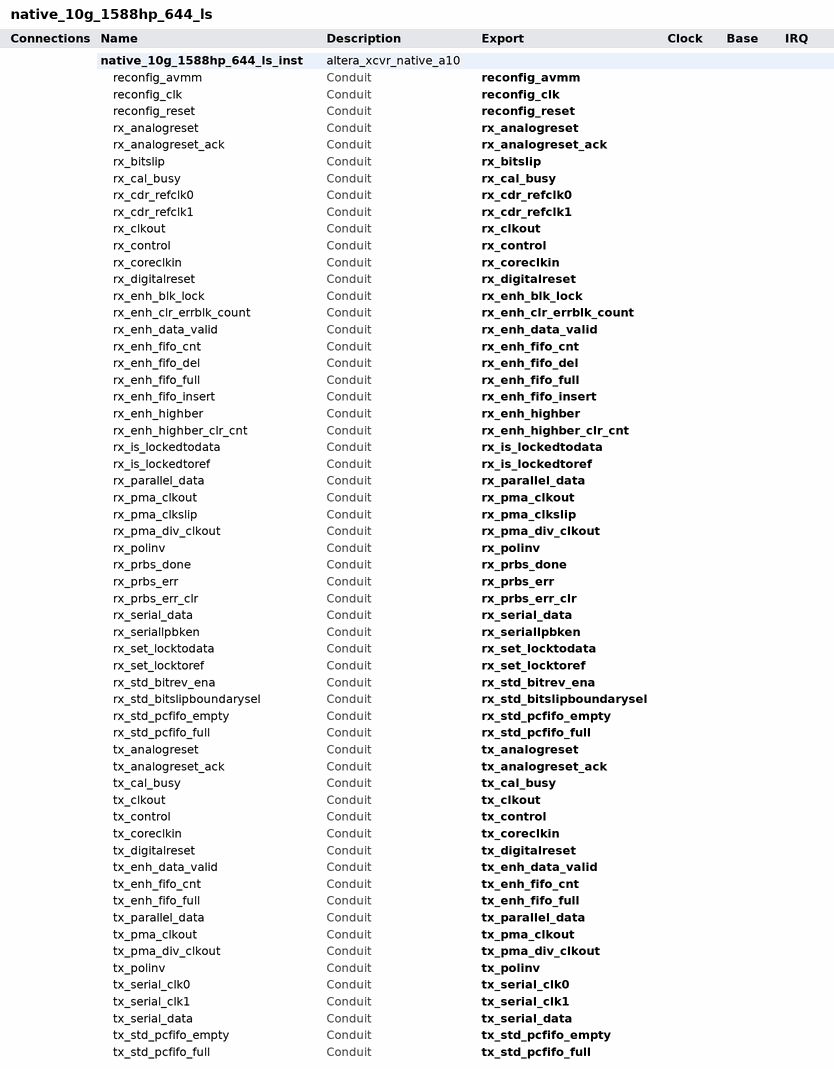
[diagram p0: system contents]
# Platform Designer (Qsys) system native_10g_1588hp_644_ls, Arria 10 10AX115U3F45I2SGE2
# Parameters at their usual value, and those the tool derives, are not listed.
package require -exact qsys 15.1
create_system native_10g_1588hp_644_ls
set_project_property DEVICE_FAMILY {Arria 10}
set_project_property DEVICE 10AX115U3F45I2SGE2

add_instance native_10g_1588hp_644_ls_inst altera_xcvr_native_a10 15.1
set_instance_property native_10g_1588hp_644_ls_inst AUTO_EXPORT true
set_instance_parameter_value native_10g_1588hp_644_ls_inst anlg_voltage 1_0V
set_instance_parameter_value native_10g_1588hp_644_ls_inst base_device NIGHTFURY5ES2
set_instance_parameter_value native_10g_1588hp_644_ls_inst bonded_mode not_bonded
set_instance_parameter_value native_10g_1588hp_644_ls_inst cdr_refclk_cnt 2
set_instance_parameter_value native_10g_1588hp_644_ls_inst channels 1
set_instance_parameter_value native_10g_1588hp_644_ls_inst disconnect_analog_resets 0
set_instance_parameter_value native_10g_1588hp_644_ls_inst enable_port_rx_analog_reset_ack 1
set_instance_parameter_value native_10g_1588hp_644_ls_inst enable_port_rx_enh_bitslip 1
set_instance_parameter_value native_10g_1588hp_644_ls_inst enable_port_rx_enh_blk_lock 1
set_instance_parameter_value native_10g_1588hp_644_ls_inst enable_port_rx_enh_clr_errblk_count 1
set_instance_parameter_value native_10g_1588hp_644_ls_inst enable_port_rx_enh_data_valid 1
set_instance_parameter_value native_10g_1588hp_644_ls_inst enable_port_rx_enh_fifo_cnt 1
set_instance_parameter_value native_10g_1588hp_644_ls_inst enable_port_rx_enh_fifo_del 1
set_instance_parameter_value native_10g_1588hp_644_ls_inst enable_port_rx_enh_fifo_full 1
set_instance_parameter_value native_10g_1588hp_644_ls_inst enable_port_rx_enh_fifo_insert 1
set_instance_parameter_value native_10g_1588hp_644_ls_inst enable_port_rx_enh_fifo_rd_en 0
set_instance_parameter_value native_10g_1588hp_644_ls_inst enable_port_rx_enh_highber 1
set_instance_parameter_value native_10g_1588hp_644_ls_inst enable_port_rx_enh_highber_clr_cnt 1
set_instance_parameter_value native_10g_1588hp_644_ls_inst enable_port_rx_pma_clkout 1
set_instance_parameter_value native_10g_1588hp_644_ls_inst enable_port_rx_pma_clkslip 1
set_instance_parameter_value native_10g_1588hp_644_ls_inst enable_port_rx_pma_div_clkout 1
set_instance_parameter_value native_10g_1588hp_644_ls_inst enable_port_rx_polinv 1
set_instance_parameter_value native_10g_1588hp_644_ls_inst enable_port_rx_seriallpbken_tx 0
set_instance_parameter_value native_10g_1588hp_644_ls_inst enable_port_rx_std_bitrev_ena 1
set_instance_parameter_value native_10g_1588hp_644_ls_inst enable_port_rx_std_bitslip 0
set_instance_parameter_value native_10g_1588hp_644_ls_inst enable_port_rx_std_bitslipboundarysel 1
set_instance_parameter_value native_10g_1588hp_644_ls_inst enable_port_rx_std_pcfifo_empty 1
set_instance_parameter_value native_10g_1588hp_644_ls_inst enable_port_rx_std_pcfifo_full 1
set_instance_parameter_value native_10g_1588hp_644_ls_inst enable_port_tx_analog_reset_ack 1
set_instance_parameter_value native_10g_1588hp_644_ls_inst enable_port_tx_enh_fifo_cnt 1
set_instance_parameter_value native_10g_1588hp_644_ls_inst enable_port_tx_enh_fifo_full 1
set_instance_parameter_value native_10g_1588hp_644_ls_inst enable_port_tx_enh_fifo_pfull 0
set_instance_parameter_value native_10g_1588hp_644_ls_inst enable_port_tx_pma_clkout 1
set_instance_parameter_value native_10g_1588hp_644_ls_inst enable_port_tx_pma_div_clkout 1
set_instance_parameter_value native_10g_1588hp_644_ls_inst enable_port_tx_polinv 1
set_instance_parameter_value native_10g_1588hp_644_ls_inst enable_port_tx_std_pcfifo_empty 1
set_instance_parameter_value native_10g_1588hp_644_ls_inst enable_port_tx_std_pcfifo_full 1
set_instance_parameter_value native_10g_1588hp_644_ls_inst enable_ports_rx_manual_cdr_mode 1
set_instance_parameter_value native_10g_1588hp_644_ls_inst enable_ports_rx_prbs 1
set_instance_parameter_value native_10g_1588hp_644_ls_inst enable_simple_interface 0
set_instance_parameter_value native_10g_1588hp_644_ls_inst enh_pcs_pma_width 40
set_instance_parameter_value native_10g_1588hp_644_ls_inst enh_pld_pcs_width 66
set_instance_parameter_value native_10g_1588hp_644_ls_inst enh_rx_64b66b_enable 1
set_instance_parameter_value native_10g_1588hp_644_ls_inst enh_rx_blksync_enable 1
set_instance_parameter_value native_10g_1588hp_644_ls_inst enh_rx_descram_enable 1
set_instance_parameter_value native_10g_1588hp_644_ls_inst enh_rxfifo_mode Register
set_instance_parameter_value native_10g_1588hp_644_ls_inst enh_tx_64b66b_enable 1
set_instance_parameter_value native_10g_1588hp_644_ls_inst enh_tx_scram_enable 1
set_instance_parameter_value native_10g_1588hp_644_ls_inst enh_tx_scram_seed 288230376151711743
set_instance_parameter_value native_10g_1588hp_644_ls_inst enh_txfifo_mode {Fast register}
set_instance_parameter_value native_10g_1588hp_644_ls_inst generate_add_hdl_instance_example 1
set_instance_parameter_value native_10g_1588hp_644_ls_inst generate_docs 1
set_instance_parameter_value native_10g_1588hp_644_ls_inst plls 2
set_instance_parameter_value native_10g_1588hp_644_ls_inst protocol_mode teng_1588_mode
set_instance_parameter_value native_10g_1588hp_644_ls_inst rapid_validate 0
set_instance_parameter_value native_10g_1588hp_644_ls_inst rcfg_h_file_enable 1
set_instance_parameter_value native_10g_1588hp_644_ls_inst rcfg_iface_enable 1
set_instance_parameter_value native_10g_1588hp_644_ls_inst rcfg_jtag_enable 1
set_instance_parameter_value native_10g_1588hp_644_ls_inst rcfg_mif_file_enable 1
set_instance_parameter_value native_10g_1588hp_644_ls_inst rcfg_multi_enable 1
set_instance_parameter_value native_10g_1588hp_644_ls_inst rcfg_profile_cnt 2
set_instance_parameter_value native_10g_1588hp_644_ls_inst rcfg_profile_select 0
set_instance_parameter_value native_10g_1588hp_644_ls_inst rcfg_reduced_files_enable 1
set_instance_parameter_value native_10g_1588hp_644_ls_inst rcfg_separate_avmm_busy 0
set_instance_parameter_value native_10g_1588hp_644_ls_inst rcfg_shared 0
set_instance_parameter_value native_10g_1588hp_644_ls_inst rcfg_sv_file_enable 1
set_instance_parameter_value native_10g_1588hp_644_ls_inst rx_pma_div_clkout_divider 33
set_instance_parameter_value native_10g_1588hp_644_ls_inst set_capability_reg_enable 1
set_instance_parameter_value native_10g_1588hp_644_ls_inst set_cdr_refclk_freq 644.531250
set_instance_parameter_value native_10g_1588hp_644_ls_inst set_csr_soft_logic_enable 1
set_instance_parameter_value native_10g_1588hp_644_ls_inst set_data_rate 10312.5
set_instance_parameter_value native_10g_1588hp_644_ls_inst set_embedded_debug_enable 1
set_instance_parameter_value native_10g_1588hp_644_ls_inst set_odi_soft_logic_enable 0
set_instance_parameter_value native_10g_1588hp_644_ls_inst set_prbs_soft_logic_enable 1
set_instance_parameter_value native_10g_1588hp_644_ls_inst std_pcs_pma_width 10
set_instance_parameter_value native_10g_1588hp_644_ls_inst std_rx_8b10b_enable 1
set_instance_parameter_value native_10g_1588hp_644_ls_inst std_rx_byte_deser_mode Disabled
set_instance_parameter_value native_10g_1588hp_644_ls_inst std_rx_polinv_enable 0
set_instance_parameter_value native_10g_1588hp_644_ls_inst std_rx_word_aligner_mode {synchronous state machine}
set_instance_parameter_value native_10g_1588hp_644_ls_inst std_rx_word_aligner_pattern_len 10
set_instance_parameter_value native_10g_1588hp_644_ls_inst std_tx_8b10b_enable 1
set_instance_parameter_value native_10g_1588hp_644_ls_inst std_tx_byte_ser_mode Disabled
set_instance_parameter_value native_10g_1588hp_644_ls_inst std_tx_polinv_enable 0
set_instance_parameter_value native_10g_1588hp_644_ls_inst tx_pma_div_clkout_divider 33

# exported interfaces
add_interface reconfig_avmm conduit end
set_interface_property reconfig_avmm EXPORT_OF native_10g_1588hp_644_ls_inst.reconfig_avmm
add_interface reconfig_clk conduit end
set_interface_property reconfig_clk EXPORT_OF native_10g_1588hp_644_ls_inst.reconfig_clk
add_interface reconfig_reset conduit end
set_interface_property reconfig_reset EXPORT_OF native_10g_1588hp_644_ls_inst.reconfig_reset
add_interface rx_analogreset conduit end
set_interface_property rx_analogreset EXPORT_OF native_10g_1588hp_644_ls_inst.rx_analogreset
add_interface rx_analogreset_ack conduit end
set_interface_property rx_analogreset_ack EXPORT_OF native_10g_1588hp_644_ls_inst.rx_analogreset_ack
add_interface rx_bitslip conduit end
set_interface_property rx_bitslip EXPORT_OF native_10g_1588hp_644_ls_inst.rx_bitslip
add_interface rx_cal_busy conduit end
set_interface_property rx_cal_busy EXPORT_OF native_10g_1588hp_644_ls_inst.rx_cal_busy
add_interface rx_cdr_refclk0 conduit end
set_interface_property rx_cdr_refclk0 EXPORT_OF native_10g_1588hp_644_ls_inst.rx_cdr_refclk0
add_interface rx_cdr_refclk1 conduit end
set_interface_property rx_cdr_refclk1 EXPORT_OF native_10g_1588hp_644_ls_inst.rx_cdr_refclk1
add_interface rx_clkout conduit end
set_interface_property rx_clkout EXPORT_OF native_10g_1588hp_644_ls_inst.rx_clkout
add_interface rx_control conduit end
set_interface_property rx_control EXPORT_OF native_10g_1588hp_644_ls_inst.rx_control
add_interface rx_coreclkin conduit end
set_interface_property rx_coreclkin EXPORT_OF native_10g_1588hp_644_ls_inst.rx_coreclkin
add_interface rx_digitalreset conduit end
set_interface_property rx_digitalreset EXPORT_OF native_10g_1588hp_644_ls_inst.rx_digitalreset
add_interface rx_enh_blk_lock conduit end
set_interface_property rx_enh_blk_lock EXPORT_OF native_10g_1588hp_644_ls_inst.rx_enh_blk_lock
add_interface rx_enh_clr_errblk_count conduit end
set_interface_property rx_enh_clr_errblk_count EXPORT_OF native_10g_1588hp_644_ls_inst.rx_enh_clr_errblk_count
add_interface rx_enh_data_valid conduit end
set_interface_property rx_enh_data_valid EXPORT_OF native_10g_1588hp_644_ls_inst.rx_enh_data_valid
add_interface rx_enh_fifo_cnt conduit end
set_interface_property rx_enh_fifo_cnt EXPORT_OF native_10g_1588hp_644_ls_inst.rx_enh_fifo_cnt
add_interface rx_enh_fifo_del conduit end
set_interface_property rx_enh_fifo_del EXPORT_OF native_10g_1588hp_644_ls_inst.rx_enh_fifo_del
add_interface rx_enh_fifo_full conduit end
set_interface_property rx_enh_fifo_full EXPORT_OF native_10g_1588hp_644_ls_inst.rx_enh_fifo_full
add_interface rx_enh_fifo_insert conduit end
set_interface_property rx_enh_fifo_insert EXPORT_OF native_10g_1588hp_644_ls_inst.rx_enh_fifo_insert
add_interface rx_enh_highber conduit end
set_interface_property rx_enh_highber EXPORT_OF native_10g_1588hp_644_ls_inst.rx_enh_highber
add_interface rx_enh_highber_clr_cnt conduit end
set_interface_property rx_enh_highber_clr_cnt EXPORT_OF native_10g_1588hp_644_ls_inst.rx_enh_highber_clr_cnt
add_interface rx_is_lockedtodata conduit end
set_interface_property rx_is_lockedtodata EXPORT_OF native_10g_1588hp_644_ls_inst.rx_is_lockedtodata
add_interface rx_is_lockedtoref conduit end
set_interface_property rx_is_lockedtoref EXPORT_OF native_10g_1588hp_644_ls_inst.rx_is_lockedtoref
add_interface rx_parallel_data conduit end
set_interface_property rx_parallel_data EXPORT_OF native_10g_1588hp_644_ls_inst.rx_parallel_data
add_interface rx_pma_clkout conduit end
set_interface_property rx_pma_clkout EXPORT_OF native_10g_1588hp_644_ls_inst.rx_pma_clkout
add_interface rx_pma_clkslip conduit end
set_interface_property rx_pma_clkslip EXPORT_OF native_10g_1588hp_644_ls_inst.rx_pma_clkslip
add_interface rx_pma_div_clkout conduit end
set_interface_property rx_pma_div_clkout EXPORT_OF native_10g_1588hp_644_ls_inst.rx_pma_div_clkout
add_interface rx_polinv conduit end
set_interface_property rx_polinv EXPORT_OF native_10g_1588hp_644_ls_inst.rx_polinv
add_interface rx_prbs_done conduit end
set_interface_property rx_prbs_done EXPORT_OF native_10g_1588hp_644_ls_inst.rx_prbs_done
add_interface rx_prbs_err conduit end
set_interface_property rx_prbs_err EXPORT_OF native_10g_1588hp_644_ls_inst.rx_prbs_err
add_interface rx_prbs_err_clr conduit end
set_interface_property rx_prbs_err_clr EXPORT_OF native_10g_1588hp_644_ls_inst.rx_prbs_err_clr
add_interface rx_serial_data conduit end
set_interface_property rx_serial_data EXPORT_OF native_10g_1588hp_644_ls_inst.rx_serial_data
add_interface rx_seriallpbken conduit end
set_interface_property rx_seriallpbken EXPORT_OF native_10g_1588hp_644_ls_inst.rx_seriallpbken
add_interface rx_set_locktodata conduit end
set_interface_property rx_set_locktodata EXPORT_OF native_10g_1588hp_644_ls_inst.rx_set_locktodata
add_interface rx_set_locktoref conduit end
set_interface_property rx_set_locktoref EXPORT_OF native_10g_1588hp_644_ls_inst.rx_set_locktoref
add_interface rx_std_bitrev_ena conduit end
set_interface_property rx_std_bitrev_ena EXPORT_OF native_10g_1588hp_644_ls_inst.rx_std_bitrev_ena
add_interface rx_std_bitslipboundarysel conduit end
set_interface_property rx_std_bitslipboundarysel EXPORT_OF native_10g_1588hp_644_ls_inst.rx_std_bitslipboundarysel
add_interface rx_std_pcfifo_empty conduit end
set_interface_property rx_std_pcfifo_empty EXPORT_OF native_10g_1588hp_644_ls_inst.rx_std_pcfifo_empty
add_interface rx_std_pcfifo_full conduit end
set_interface_property rx_std_pcfifo_full EXPORT_OF native_10g_1588hp_644_ls_inst.rx_std_pcfifo_full
add_interface tx_analogreset conduit end
set_interface_property tx_analogreset EXPORT_OF native_10g_1588hp_644_ls_inst.tx_analogreset
add_interface tx_analogreset_ack conduit end
set_interface_property tx_analogreset_ack EXPORT_OF native_10g_1588hp_644_ls_inst.tx_analogreset_ack
add_interface tx_cal_busy conduit end
set_interface_property tx_cal_busy EXPORT_OF native_10g_1588hp_644_ls_inst.tx_cal_busy
add_interface tx_clkout conduit end
set_interface_property tx_clkout EXPORT_OF native_10g_1588hp_644_ls_inst.tx_clkout
add_interface tx_control conduit end
set_interface_property tx_control EXPORT_OF native_10g_1588hp_644_ls_inst.tx_control
add_interface tx_coreclkin conduit end
set_interface_property tx_coreclkin EXPORT_OF native_10g_1588hp_644_ls_inst.tx_coreclkin
add_interface tx_digitalreset conduit end
set_interface_property tx_digitalreset EXPORT_OF native_10g_1588hp_644_ls_inst.tx_digitalreset
add_interface tx_enh_data_valid conduit end
set_interface_property tx_enh_data_valid EXPORT_OF native_10g_1588hp_644_ls_inst.tx_enh_data_valid
add_interface tx_enh_fifo_cnt conduit end
set_interface_property tx_enh_fifo_cnt EXPORT_OF native_10g_1588hp_644_ls_inst.tx_enh_fifo_cnt
add_interface tx_enh_fifo_full conduit end
set_interface_property tx_enh_fifo_full EXPORT_OF native_10g_1588hp_644_ls_inst.tx_enh_fifo_full
add_interface tx_parallel_data conduit end
set_interface_property tx_parallel_data EXPORT_OF native_10g_1588hp_644_ls_inst.tx_parallel_data
add_interface tx_pma_clkout conduit end
set_interface_property tx_pma_clkout EXPORT_OF native_10g_1588hp_644_ls_inst.tx_pma_clkout
add_interface tx_pma_div_clkout conduit end
set_interface_property tx_pma_div_clkout EXPORT_OF native_10g_1588hp_644_ls_inst.tx_pma_div_clkout
add_interface tx_polinv conduit end
set_interface_property tx_polinv EXPORT_OF native_10g_1588hp_644_ls_inst.tx_polinv
add_interface tx_serial_clk0 conduit end
set_interface_property tx_serial_clk0 EXPORT_OF native_10g_1588hp_644_ls_inst.tx_serial_clk0
add_interface tx_serial_clk1 conduit end
set_interface_property tx_serial_clk1 EXPORT_OF native_10g_1588hp_644_ls_inst.tx_serial_clk1
add_interface tx_serial_data conduit end
set_interface_property tx_serial_data EXPORT_OF native_10g_1588hp_644_ls_inst.tx_serial_data
add_interface tx_std_pcfifo_empty conduit end
set_interface_property tx_std_pcfifo_empty EXPORT_OF native_10g_1588hp_644_ls_inst.tx_std_pcfifo_empty
add_interface tx_std_pcfifo_full conduit end
set_interface_property tx_std_pcfifo_full EXPORT_OF native_10g_1588hp_644_ls_inst.tx_std_pcfifo_full

set_interconnect_requirement {$system} qsys_mm.clockCrossingAdapter HANDSHAKE
set_interconnect_requirement {$system} qsys_mm.insertDefaultSlave FALSE
set_interconnect_requirement {$system} qsys_mm.maxAdditionalLatency 1

save_system native_10g_1588hp_644_ls.qsys
